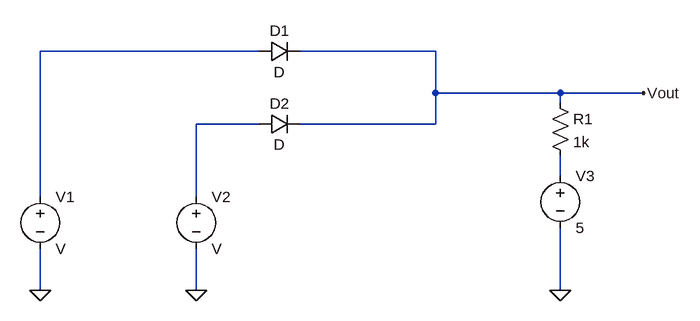
[diagram p0: schematic AND_Gate_Negative.asc]
AND_Gate_Negative.asc, the LTspice schematic file:
Version 4
SHEET 1 880 680
WIRE -144 -48 -480 -48
WIRE 128 -48 -80 -48
WIRE 128 16 128 -48
WIRE 320 16 128 16
WIRE 448 16 320 16
WIRE 320 32 320 16
WIRE -144 64 -240 64
WIRE 128 64 128 16
WIRE 128 64 -80 64
WIRE 320 144 320 112
WIRE -480 176 -480 -48
WIRE -240 176 -240 64
WIRE -480 320 -480 256
WIRE -240 320 -240 256
WIRE 320 320 320 224
FLAG -480 320 0
FLAG -240 320 0
FLAG 320 320 0
FLAG 448 16 Vout
SYMBOL voltage -480 160 R0
SYMATTR InstName V1
SYMBOL voltage -240 160 R0
SYMATTR InstName V2
SYMBOL res 304 16 R0
SYMATTR InstName R1
SYMATTR Value 1k
SYMBOL voltage 320 128 R0
WINDOW 123 0 0 Left 0
WINDOW 39 0 0 Left 0
SYMATTR InstName V3
SYMATTR Value 5
SYMBOL diode -144 -32 R270
WINDOW 0 32 32 VTop 2
WINDOW 3 0 32 VBottom 2
SYMATTR InstName D1
SYMBOL diode -144 80 R270
WINDOW 0 32 32 VTop 2
WINDOW 3 0 32 VBottom 2
SYMATTR InstName D2

The netlist it stands for:
* AND_Gate_Negative.asc
V1 N001 0 V
V2 N002 0 V
R1 Vout N003 1k
V3 N003 0 5
D1 N001 Vout D
D2 N002 Vout D
.model D D
.lib standard.dio
.backanno
.end